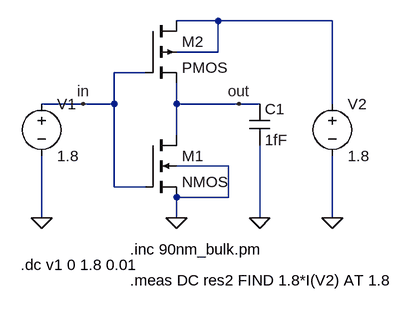
[diagram p0: schematic statpowerconventional@1.8.asc]
statpowerconventional@1.8.asc, the LTspice schematic file:
Version 4
SHEET 1 880 680
WIRE 272 -48 208 -48
WIRE 448 -48 272 -48
WIRE 272 0 272 -48
WIRE 272 0 208 0
WIRE 160 32 112 32
WIRE 64 80 0 80
WIRE 112 80 112 32
WIRE 112 80 64 80
WIRE 208 80 208 48
WIRE 304 80 208 80
WIRE 336 80 304 80
WIRE 448 80 448 -48
WIRE 208 128 208 80
WIRE 288 176 208 176
WIRE 112 208 112 80
WIRE 160 208 112 208
WIRE 288 224 288 176
WIRE 288 224 208 224
WIRE 0 256 0 160
WIRE 208 256 208 224
WIRE 336 256 336 144
WIRE 448 256 448 160
FLAG 208 256 0
FLAG 336 256 0
FLAG 448 256 0
FLAG 0 256 0
FLAG 64 80 in
FLAG 304 80 out
SYMBOL nmos4 160 128 R0
SYMATTR InstName M1
SYMATTR Value2 l=100n w=1500n
SYMBOL pmos4 160 -48 R0
SYMATTR InstName M2
SYMATTR Value2 l=100n w=4170n
SYMBOL voltage 0 64 R0
SYMATTR InstName V1
SYMATTR Value 1.8
SYMBOL voltage 448 64 R0
WINDOW 123 0 0 Left 0
WINDOW 39 0 0 Left 0
SYMATTR InstName V2
SYMATTR Value 1.8
SYMBOL cap 320 80 R0
SYMATTR InstName C1
SYMATTR Value 1fF
TEXT 136 304 Left 2 !.inc 90nm_bulk.pm
TEXT -32 328 Left 2 !.dc v1 0 1.8 0.01
TEXT 136 352 Left 2 !.meas DC res2 FIND 1.8*I(V2) AT 1.8

The netlist it stands for:
* statpowerconventional@1.8.asc
M1 out in 0 0 NMOS l=100n w=1500n
M2 N001 in out N001 PMOS l=100n w=4170n
V1 in 0 1.8
V2 N001 0 1.8
C1 out 0 1fF
.model NMOS NMOS
.model PMOS PMOS
.lib standard.mos
.inc 90nm_bulk.pm
.dc v1 0 1.8 0.01
.meas DC res2 FIND 1.8*I(V2) AT 1.8
.backanno
.end